# Altium schematic sheet 96B垂直控制原理.SchDoc
size A2
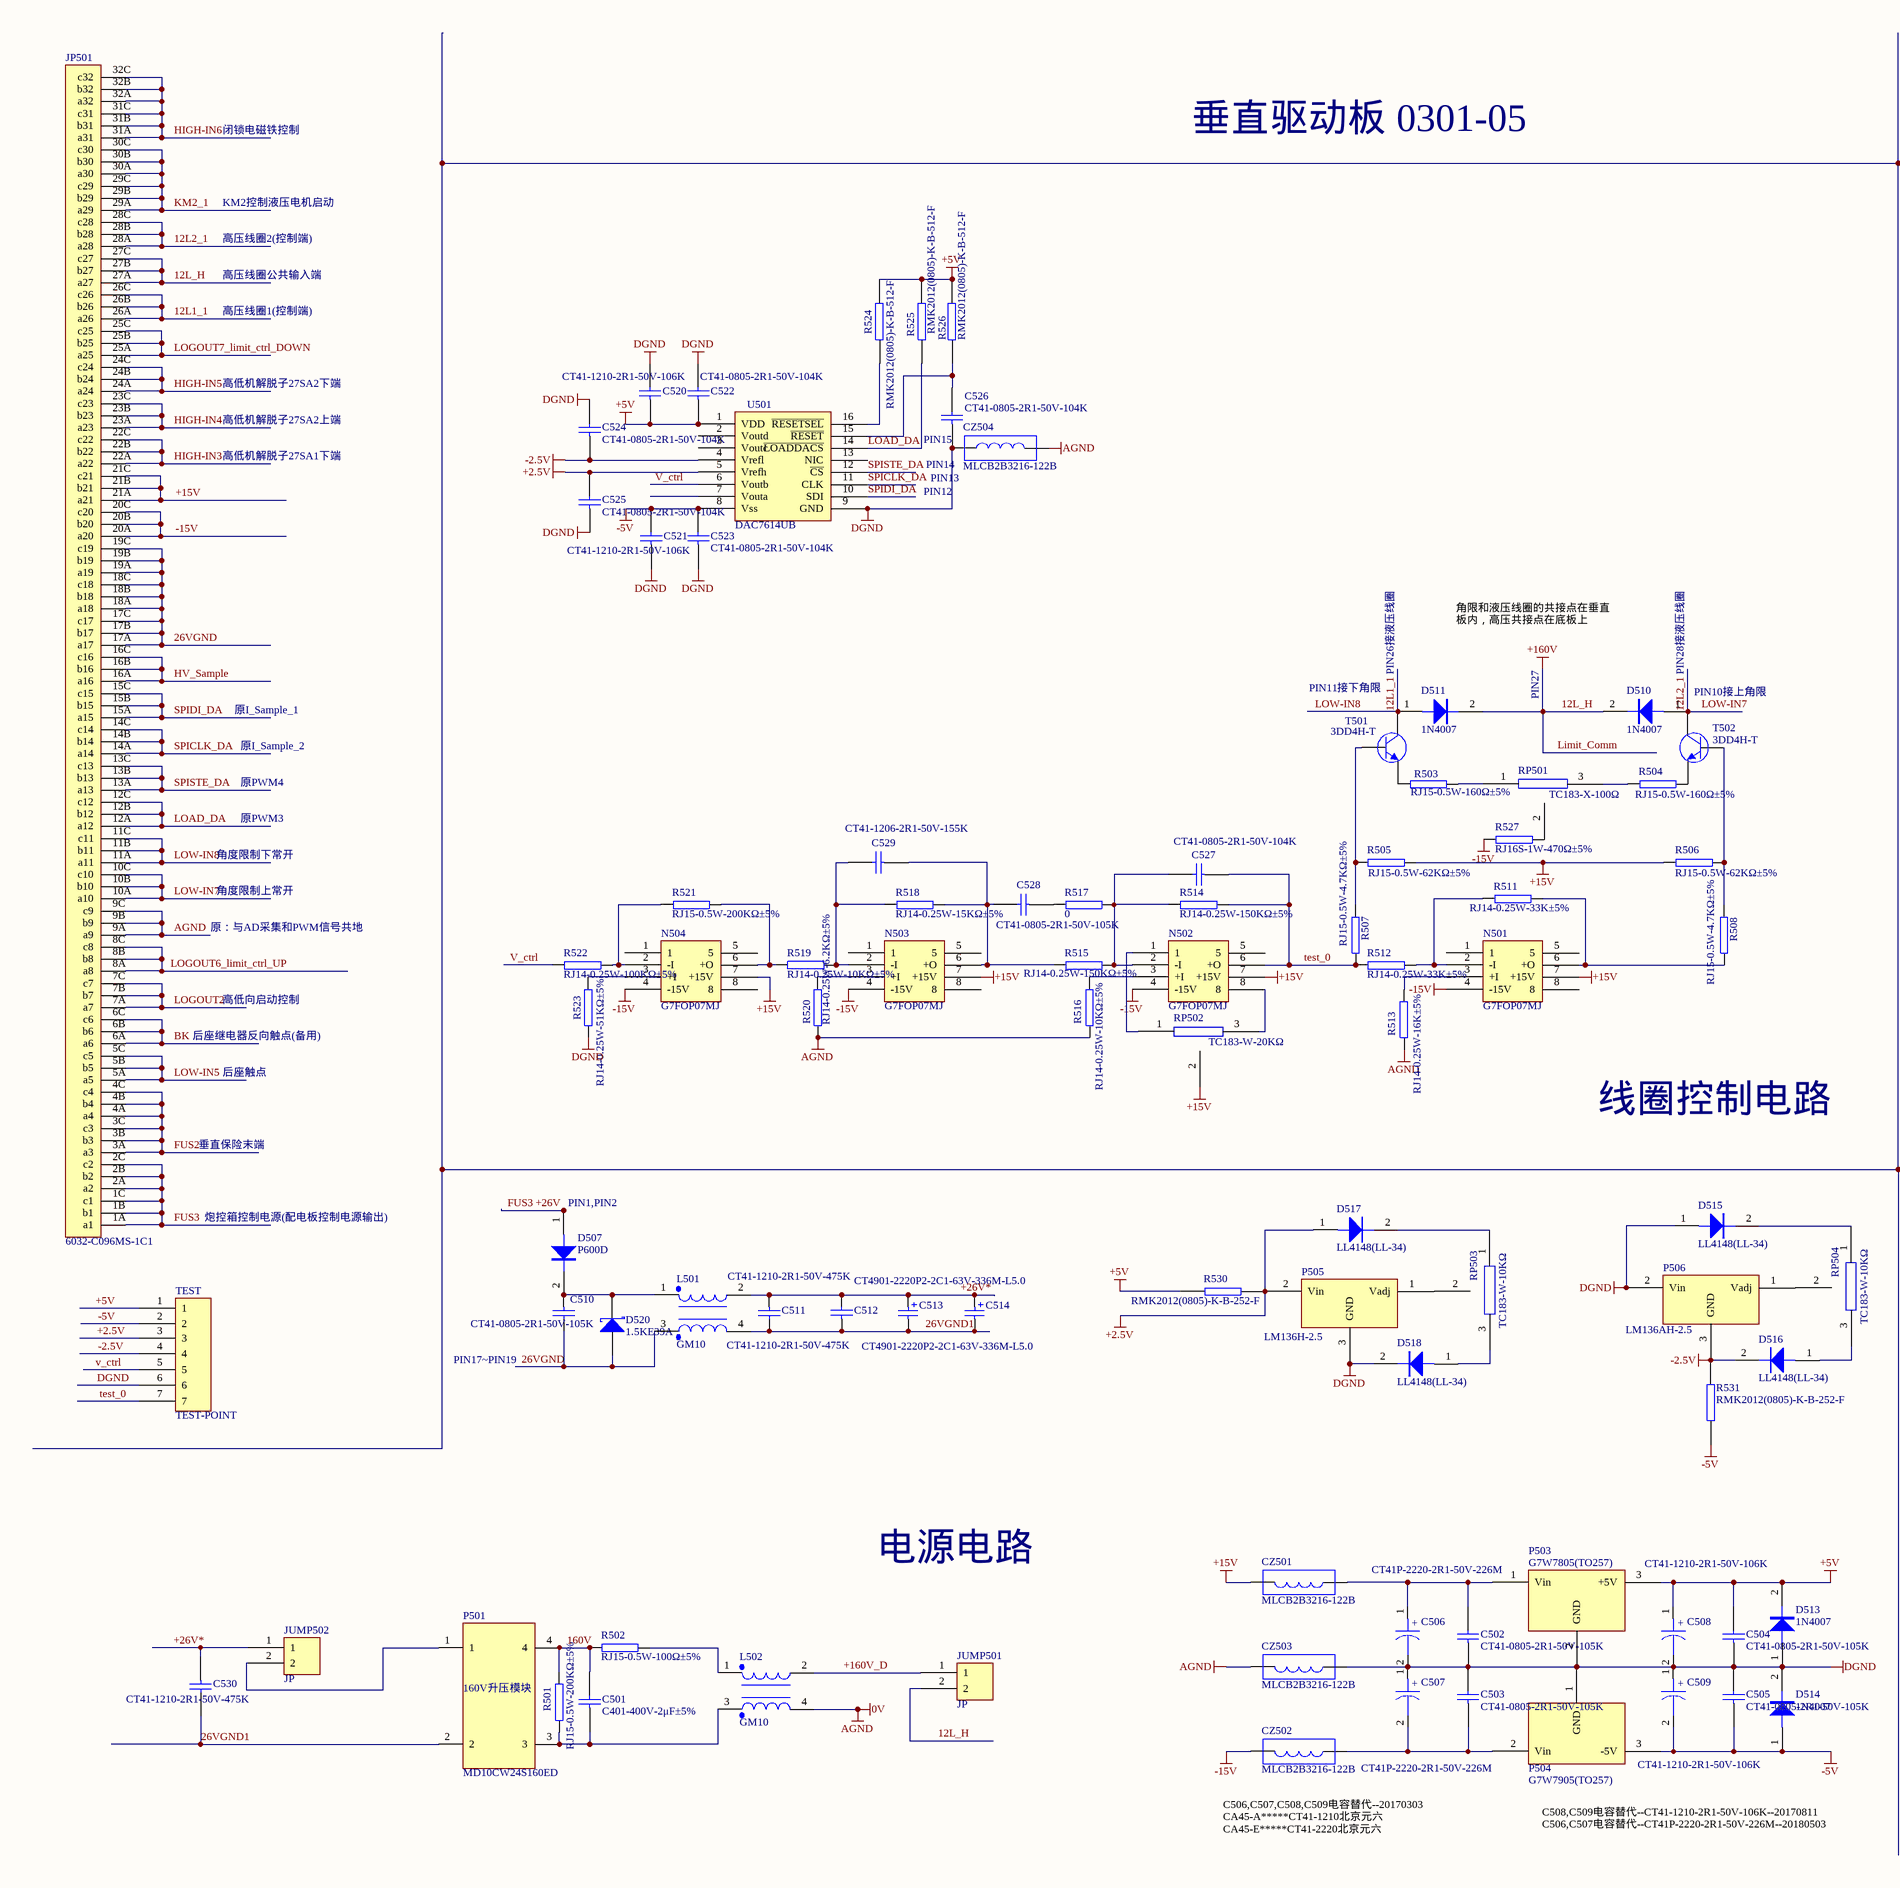
[diagram p0: 96B垂直控制原理.SchDoc, left]
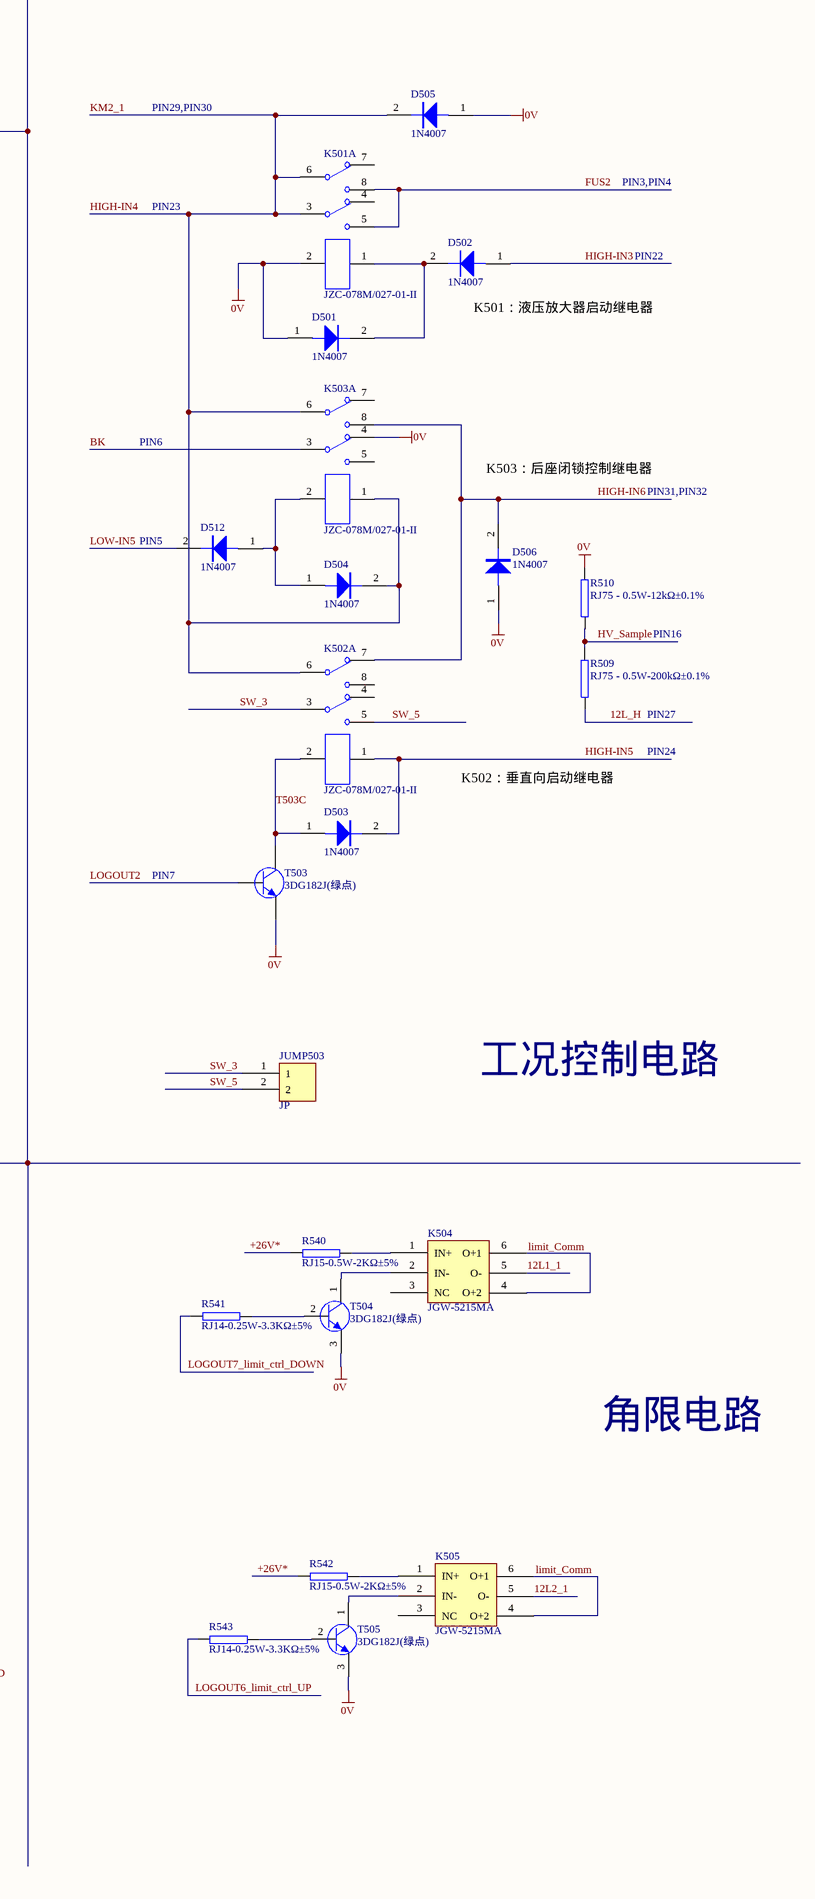
[diagram p1: 96B垂直控制原理.SchDoc, right]

## Parts
C501  C401-400V-2μF±5%  [C400V2U]
C502  CT41-0805-2R1-50V-105K  [0805]
C503  CT41-0805-2R1-50V-105K  [0805]
C504  CT41-0805-2R1-50V-105K  [0805]
C505  CT41-0805-2R1-50V-105K  [0805]
C506  CT41P-2220-2R1-50V-226M  [2220]
C507  CT41P-2220-2R1-50V-226M  [2220]
C508  CT41-1210-2R1-50V-106K  [1210]
C509  CT41-1210-2R1-50V-106K  [1210]
C510  CT41-0805-2R1-50V-105K  [0805]
C511  CT41-1210-2R1-50V-475K  [1210]
C512  CT41-1210-2R1-50V-475K  [1210]
C513  CT4901-2220P2-2C1-63V-336M-L5.0  [2220]
C514  CT4901-2220P2-2C1-63V-336M-L5.0  [2220]
C520  CT41-1210-2R1-50V-106K  [1210]
C521  CT41-1210-2R1-50V-106K  [1210]
C522  CT41-0805-2R1-50V-104K  [0805]
C523  CT41-0805-2R1-50V-104K  [0805]
C524  CT41-0805-2R1-50V-104K  [0805]
C525  CT41-0805-2R1-50V-104K  [0805]
C526  CT41-0805-2R1-50V-104K  [0805]
C527  CT41-0805-2R1-50V-104K  [0805]
C528  CT41-0805-2R1-50V-105K  [0805]
C529  CT41-1206-2R1-50V-155K  [1206]
C530  CT41-1210-2R1-50V-475K  [1210]
CZ501  MLCB2B3216-122B  [MLCB2B3216]
CZ502  MLCB2B3216-122B  [MLCB2B3216]
CZ503  MLCB2B3216-122B  [MLCB2B3216]
CZ504  MLCB2B3216-122B  [MLCB2B3216]
D501  1N4007  [Do-0.4]
D502  1N4007  [Do-0.4]
D503  1N4007  [Do-0.4]
D504  1N4007  [Do-0.4]
D505  1N4007  [Do-0.4]
D506  1N4007  [Do-0.4]
D507  P600D  [P600D]
D510  1N4007  [Do-0.4]
D511  1N4007  [Do-0.4]
D512  1N4007  [Do-0.4]
D513  1N4007  [Do-0.4]
D514  1N4007  [Do-0.4]
D515  LL4148(LL-34)  [D-LL34]
D516  LL4148(LL-34)  [D-LL34]
D517  LL4148(LL-34)  [D-LL34]
D518  LL4148(LL-34)  [D-LL34]
D520  1.5KE39A  [DIODE-0.7]
JP501  6032-C096MS-1C1  [AMP-174111-1]
JUMP501  JP  [JP]
JUMP502  JP  [JP]
JUMP503  JP  [JP]
K501  JZC-078M/027-01-II  [JZC-078M]  (part A of 5)
K502  JZC-078M/027-01-II  [JZC-078M]  (part A of 5)
K503  JZC-078M/027-01-II  [JZC-078M]  (part A of 5)
K504  JGW-5215MA  [JGW-5215MA]
K505  JGW-5215MA  [JGW-5215MA]
L501  GM10  [GM10]
L502  GM10  [GM10]
N501  G7FOP07MJ  [DIP8]
N502  G7FOP07MJ  [DIP8]
N503  G7FOP07MJ  [DIP8]
N504  G7FOP07MJ  [DIP8]
P501  MD10CW24S160ED  [MD10CW24S160ED]
P503  G7W7805(TO257)  [TO-220H - Modify]
P504  G7W7905(TO257)  [TO-220H - Modify]
P505  LM136H-2.5  [TO-46]
P506  LM136AH-2.5  [TO-46]
R501  RJ15-0.5W-200KΩ±5%  [Res-0.5W]
R502  RJ15-0.5W-100Ω±5%  [Res-0.5W]
R503  RJ15-0.5W-160Ω±5%  [Res-0.5W]
R504  RJ15-0.5W-160Ω±5%  [Res-0.5W]
R505  RJ15-0.5W-62KΩ±5%  [Res-0.5W]
R506  RJ15-0.5W-62KΩ±5%  [Res-0.5W]
R507  RJ15-0.5W-4.7KΩ±5%  [Res-0.5W]
R508  RJ15-0.5W-4.7KΩ±5%  [Res-0.5W]
R509  RJ75 - 0.5W-200kΩ±0.1%  [RJ75-0.5W]
R510  RJ75 - 0.5W-12kΩ±0.1%  [RJ75-0.5W]
R511  RJ14-0.25W-33K±5%  [Res-0.25W]
R512  RJ14-0.25W-33K±5%  [Res-0.25W]
R513  RJ14-0.25W-16K±5%  [Res-0.25W]
R514  RJ14-0.25W-150KΩ±5%  [Res-0.25W]
R515  RJ14-0.25W-150KΩ±5%  [Res-0.25W]
R516  RJ14-0.25W-10KΩ±5%  [Res-0.25W]
R517  0  [Res-0.25W]
R518  RJ14-0.25W-15KΩ±5%  [Res-0.25W]
R519  RJ14-0.25W-10KΩ±5%  [Res-0.25W]
R520  RJ14-0.25W-6.2KΩ±5%  [Res-0.25W]
R521  RJ15-0.5W-200KΩ±5%  [Res-0.5W]
R522  RJ14-0.25W-100KΩ±5%  [Res-0.25W]
R523  RJ14-0.25W-51KΩ±5%  [Res-0.25W]
R524  RMK2012(0805)-K-B-512-F  [0805]
R525  RMK2012(0805)-K-B-512-F  [0805]
R526  RMK2012(0805)-K-B-512-F  [0805]
R527  RJ16S-1W-470Ω±5%  [RJ16S-1W]
R530  RMK2012(0805)-K-B-252-F  [0805]
R531  RMK2012(0805)-K-B-252-F  [0805]
R540  RJ15-0.5W-2KΩ±5%  [Res-0.5W]
R541  RJ14-0.25W-3.3KΩ±5%  [Res-0.25W]
R542  RJ15-0.5W-2KΩ±5%  [Res-0.5W]
R543  RJ14-0.25W-3.3KΩ±5%  [Res-0.25W]
RP501  TC183-X-100Ω  [VR5]
RP502  TC183-W-20KΩ  [VR5]
RP503  TC183-W-10KΩ  [VR5]
RP504  TC183-W-10KΩ  [VR5]
T501  3DD4H-T  [3DD4H-T]
T502  3DD4H-T  [3DD4H-T]
T503  3DG182J(绿点)  [T039]
T504  3DG182J(绿点)  [T039]
T505  3DG182J(绿点)  [T039]
TEST  TEST-POINT  [TEST-POINT]
U501  DAC7614UB  [DAC7614[SOIC]]

## Nets
12L_H: D510.2 D511.2 JP501.27A(a27) JP501.27B(b27) JP501.27C(c27) JUMP501.2 R509.1  [also labelled +160V, Limit_Comm]
+2.5V: C525.2 D517.1 P505.2(Vin) R530.2 TEST.3 U501.5(Vrefh)
+5V: C504.2 C508.1 C520.1 C522.1 D513.2 P503.3(+5V) R524.2 R525.2 R526.2 R530.1 TEST.1 U501.1(VDD)
+15V: CZ501.1 JP501.21A(a21) JP501.21B(b21) JP501.21C(c21) N501.7(+15V) N502.7(+15V) N503.7(+15V) N504.7(+15V) R505.2 R506.1 RP502.2
-2.5V: C524.1 D516.2 P506.3(GND) R531.2 TEST.4 U501.4(Vrefl)
-5V: C505.1 C509.2 C521.2 C523.2 D514.1 P504.3(-5V) R531.1 TEST.2 U501.8(Vss)
-15V: CZ502.1 JP501.20A(a20) JP501.20B(b20) JP501.20C(c20) N501.4(-15V) N502.4(-15V) N503.4(-15V) N504.4(-15V) R527.1
AGND: CZ503.1 CZ504.1 D501.1 D505.1 D506.1 JP501.9A(a9) JP501.9B(b9) JP501.9C(c9) K501.2 K503.4 L502.4 R510.2 R513.1 R516.1 R520.1 T503.3(E) T504.3(E) T505.3(E)  [also labelled 0V]
DGND: C502.1 C503.2 C504.1 C505.2 C506.2 C507.1 C508.2 C509.1 C520.2 C521.1 C522.2 C523.1 C524.2 C525.1 C526.1 CZ503.2 CZ504.2 D513.1 D514.2 D515.1 D518.2 P503.2(GND) P504.1(GND) P505.3(GND) P506.2(Vin) R523.1 TEST.6 U501.9(GND)
12L1_1: D511.1 JP501.11A(a11) JP501.11B(b11) JP501.11C(c11) JP501.26A(a26) JP501.26B(b26) JP501.26C(c26) K504.5(O-) T501.1(C)  [also labelled LOW-IN8]
12L2_1: D510.1 JP501.10A(a10) JP501.10B(b10) JP501.10C(c10) JP501.28A(a28) JP501.28B(b28) JP501.28C(c28) K505.5(O-) T502.1(C)  [also labelled LOW-IN7]
26VGND: C510.2 D520.1(A) JP501.17A(a17) JP501.17B(b17) JP501.17C(c17) JP501.18A(a18) JP501.18B(b18) JP501.18C(c18) JP501.19A(a19) JP501.19B(b19) JP501.19C(c19) L501.3
26VGND1: C511.2 C512.1 C513.2 C514.2 C530.2 L501.4 P501.2
160V: C501.2 P501.4 R501.2 R502.1
+26V: D507.1 JP501.1A(a1) JP501.1B(b1) JP501.1C(c1) JP501.2A(a2) JP501.2B(b2) JP501.2C(c2)  [also labelled FUS3]
+26V*: C511.1 C512.2 C513.1 C514.1 C530.1 JUMP502.1 L501.2 R540.1 R542.1
+160V_D: JUMP501.1 L502.2
BK: JP501.6A(a6) JP501.6B(b6) JP501.6C(c6) K503.3
FUS2: JP501.3A(a3) JP501.3B(b3) JP501.3C(c3) JP501.4A(a4) JP501.4B(b4) JP501.4C(c4) K501.5 K501.8
HIGH-IN3: D502.1 JP501.22A(a22) JP501.22B(b22) JP501.22C(c22)
HIGH-IN4: D504.2 D505.2 JP501.23A(a23) JP501.23B(b23) JP501.23C(c23) JP501.29A(a29) JP501.29B(b29) JP501.29C(c29) JP501.30A(a30) JP501.30B(b30) JP501.30C(c30) K501.3 K501.6 K502.6 K503.1 K503.6  [also labelled KM2_1]
HIGH-IN5: D503.2 JP501.24A(a24) JP501.24B(b24) JP501.24C(c24) K502.1
HIGH-IN6: D506.2 JP501.31A(a31) JP501.31B(b31) JP501.31C(c31) JP501.32A(a32) JP501.32B(b32) JP501.32C(c32) K502.7 K503.8
HV_Sample: JP501.16A(a16) JP501.16B(b16) JP501.16C(c16) R509.2 R510.1
LOAD_DA: JP501.12A(a12) JP501.12B(b12) JP501.12C(c12) R525.1 U501.14(~{LOADDACS})
LOGOUT2: JP501.7A(a7) JP501.7B(b7) JP501.7C(c7) T503.2(B)
LOGOUT6_limit_ctrl_UP: JP501.8A(a8) JP501.8B(b8) JP501.8C(c8) R543.1
LOGOUT7_limit_ctrl_DOWN: JP501.25A(a25) JP501.25B(b25) JP501.25C(c25) R541.1
LOW-IN5: D512.2 JP501.5A(a5) JP501.5B(b5) JP501.5C(c5)
SPICLK_DA: JP501.14A(a14) JP501.14B(b14) JP501.14C(c14) U501.11(CLK)
SPIDI_DA: JP501.15A(a15) JP501.15B(b15) JP501.15C(c15) U501.10(SDI)
SPISTE_DA: JP501.13A(a13) JP501.13B(b13) JP501.13C(c13) U501.12(~{CS})
SW_3: JUMP503.1 K502.3
SW_5: JUMP503.2 K502.5
T503C: D503.1 K502.2 T503.1(C)
test_0: C527.1 N502.6(+O) R507.1 R512.1 R514.2 TEST.7
V_ctrl: R522.1 TEST.5 U501.6(Voutb)
NetC501_1: C501.1 L502.3 P501.3 R501.1
NetC502_2: C502.2 C506.1 CZ501.2 P503.1(Vin)
NetC503_1: C503.1 C507.2 CZ502.2 P504.2(Vin)
NetC510_1: C510.1 D507.2 D520.2(K) L501.1
NetC526_2: C526.2 R526.1 U501.15(~{RESET})
NetC527_2: C527.2 N502.2(-I) R514.1 R515.2 R517.2
NetC528_1: C528.1 R517.1
NetC528_2: C528.2 C529.1 N503.6(+O) R515.1 R518.2
NetC529_2: C529.2 N503.2(-I) R518.1 R519.1
NetD501_2: D501.2 D502.2 K501.1
NetD504_1: D504.1 D512.1 K503.2
NetD515_2: D515.2 RP504.1
NetD516_1: D516.1 RP504.3
NetD517_2: D517.2 RP503.1
NetD518_1: D518.1 RP503.3
NetJUMP502_2: JUMP502.2 P501.1
NetK504_1: K504.1(IN+) R540.2
NetK504_2: K504.2(IN-) T504.1(C)
NetK504_4: K504.4(O+2) K504.6(O+1)
NetK505_1: K505.1(IN+) R542.2
NetK505_2: K505.2(IN-) T505.1(C)
NetK505_4: K505.4(O+2) K505.6(O+1)
NetL502_1: L502.1 R502.2
NetN501_2: N501.2(-I) R511.1 R512.2
NetN501_3: N501.3(+I) R513.2
NetN501_6: N501.6(+O) R508.1 R511.2
NetN502_1: N502.1 RP502.1
NetN502_3: N502.3(+I) R516.2
NetN502_8: N502.8 RP502.3
NetN503_3: N503.3(+I) R520.2
NetN504_2: N504.2(-I) R521.1 R522.2
NetN504_3: N504.3(+I) R523.2
NetN504_6: N504.6(+O) R519.2 R521.2
NetP505_1: P505.1(Vadj) RP503.2
NetP506_1: P506.1(Vadj) RP504.2
NetR503_1: R503.1 T501.3(E)
NetR503_2: R503.2 RP501.1
NetR504_1: R504.1 RP501.3
NetR504_2: R504.2 T502.3(E)
NetR505_1: R505.1 R507.2 T501.2(B)
NetR506_2: R506.2 R508.2 T502.2(B)
NetR524_1: R524.1 U501.16(~{RESETSEL})
NetR527_2: R527.2 RP501.2
NetR541_2: R541.2 T504.2(B)
NetR543_2: R543.2 T505.2(B)

Not connected (* = marked no-connect by the designer): K501 4 7; K502 4 8; K503 5 7; K504 3(NC); K505 3(NC); N501 1 5 8; N502 5; N503 1 5 8; N504 1 5 8; U501 2(Voutd) 3(Voutc) 7(Vouta) 13(NIC)

## Notes on the sheet
- 闭锁电磁铁控制
- 垂直驱动板 0301-05
- PIN29,PIN30
- KM2控制液压电机启动
- PIN3,PIN4
- 高压线圈公共输入端
- 高压线圈2(控制端)
- PIN23
- 高压线圈1(控制端)
- (near D502) K501：液压放大器启动继电器
- PIN22
- 高低机解脱子27SA2下端
- 高低机解脱子27SA1下端
- 高低机解脱子27SA2上端
- (near C526) PIN15
- PIN14
- PIN6
- PIN12
- PIN13
- K503：后座闭锁控制继电器
- PIN31,PIN32
- (near D512) PIN5
- 角限和液压线圈的共接点在垂直板内，高压共接点在底板上
- PIN11接下角限
- PIN26接液压线圈
- PIN27
- PIN28接液压线圈
- PIN10接上角限
- PIN16
- 原I_Sample_1
- 原I_Sample_2
- 原PWM3
- 原PWM4
- K502：垂直向启动继电器
- PIN24
- 角度限制下常开
- 原：与AD采集和PWM信号共地
- 角度限制上常开
- PIN7
- 高低向启动控制
- 后座继电器反向触点(备用)
- 后座触点
- 线圈控制电路
- 工况控制电路
- 垂直保险末端
- 炮控箱控制电源(配电板控制电源输出)
- (near D507) PIN1,PIN2
- PIN17~PIN19
- 角限电路
- 电源电路
- C506,C507,C508,C509电容替代--20170303
  CA45-A*****CT41-1210北京元六
  CA45-E*****CT41-2220北京元六
- C508,C509电容替代--CT41-1210-2R1-50V-106K--20170811
  C506,C507电容替代--CT41P-2220-2R1-50V-226M--20180503
- Labels drawn without touching a wire or pin: limit_Comm
- (in symbol Cap_Pol) +
- (in symbol MD10CW24S160ED) 160V升压模块

## Library data of the parts
C501 = CaP1
C502 C504 C505 = Cap_X_1: 1uF
C503 = Cap_X_1
C506 C507 = Cap_Pol: 22uF
C508 C509 = Cap_Pol: 10uF
C510 = CAP: 1uF
C511 C512 = CAP: 4.7uF
C513 C514 = Cap Pol2: 33uF; Value: 47u/64V; Published: 8-Jun-2000; LatestRevisionDate: 17-Jul-2002; LatestRevisionNote: Re-released for DXP Platform.; PackageReference: POLAR0.8; Publisher: Altium Limited
C520 C521 = Cap_X_2: 10uF
C522-C527 = Cap_X_2: 0.1uF
C528 = Cap_X_2: 1uF
C529 = Cap_X_2: 1.5uF
C530 = Cap_X_2
CZ501-CZ504 = CZH
D515-D518 = IN4148: SMK4148(LL-34)
D520 = Diode 11DQ03: Schottky Rectifier; Published: 8-Jun-2000; LatestRevisionDate: 17-Jul-2002; LatestRevisionNote: Re-released for DXP Platform.; DatasheetDocument: Dec-1997; PackageReference: DO-204AL; Publisher: Altium Limited; ComponentLink1Description: Manufacturer Link; ComponentLink1URL: http://www.irf.com/; ComponentLink2Description: Datasheet; ComponentLink2URL: http://www.irf.com/product-info/datasheets/data/11dq03.pdf; Code_JEDEC: DO-204-AL
JP501 = AMP-174111-1
K501-K503 = Relay-DPDT
L501 L502 = L-GONGMO
P501 = MD10CW24S160ED: 力源兴达，电源引脚做反了
P503 = MC7805T
P504 = MC7905T
P505 = LM136AH-2.5
R501-R503 R540 R542 = R-0.5W
R504 = Rx: RJ15-0.5W-180Ω±5%-±100×10-6/K-SJ/T10872-2000
R505 R506 = Rx: RJ15-0.5W-62KΩ±5%-±100×10-6/K-SJ/T10872-2000
R507 R508 = Rx
R509 = R-0.5W: RJ75 - 0.5W-200kΩ±0.1%±25×10^-6/K - GJB1929-1994
R510 = R-0.5W: RJ75 - 0.5W-12kΩ±0.1%±25×10^-6/K - GJB1929-1994
R511-R523 R541 R543 = R-0.25W
R524-R526 = RES2: 5.1K
R527 = R-5W
R530 R531 = RES2: 2.5K
RP501-RP504 = Rp
T501 T502 = 3DD4H-T: GB4314-84
T503-T505 = 3DG182
U501 = DAC7614